# Altium schematic sheet CHARGING.SchDoc
size A; SheetNumber: 3; SheetTotal: 5
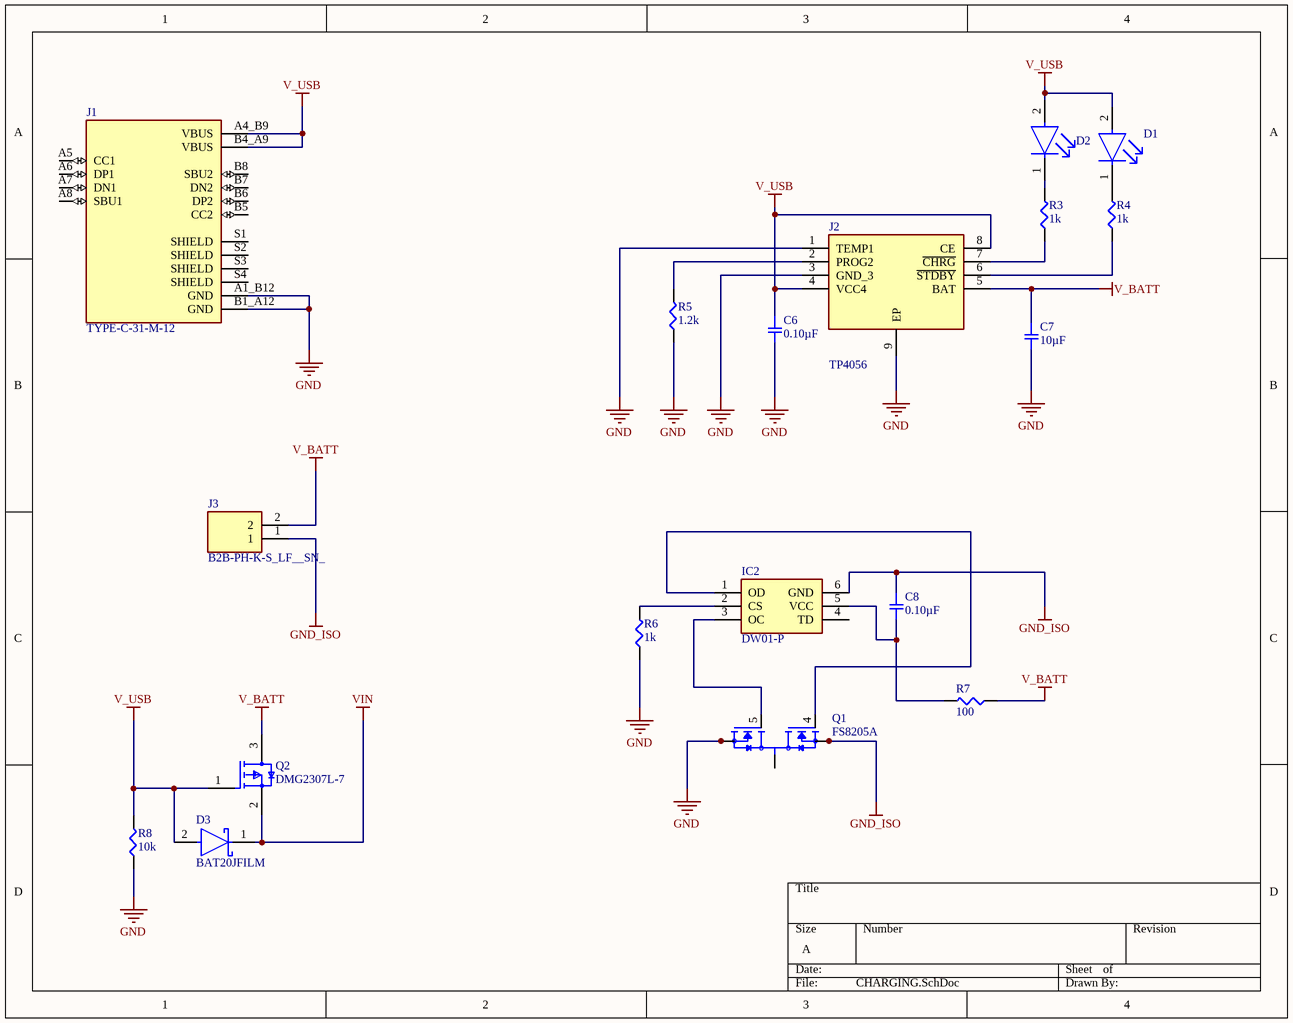
[diagram p0: CHARGING.SchDoc]

## Parts
C6  0.10µF  [SMD-0402C]
C7  10µF  [SMD-0402C]
C8  0.10µF  [SMD-0402C]
D1  SML-P12VTT86R  [FP-SML-P1-MFG]  (value not drawn)
D2  APHHS1005CGCK  [FP-APHHS1005CGCK-MFG]  (value not drawn)
D3  BAT20JFILM  [FP-BAT20JFILM-MFG]
IC2  DW01-P  [SOT95P280X135-6N]
J1  TYPE-C-31-M-12  [HRO_TYPE-C-31-M-12]
J2  TP4056  [SOIC127P600X175-9N]
J3  B2B-PH-K-S_LF__SN_  [SHDR2W50P0X200_1X2_590X450X600P]
Q1  FS8205A  [SOP65P640X120-8N]
Q2  DMG2307L-7  [FP-SOT23-MFG]
R3  1k  [SMD-0402-RES]
R4  1k  [SMD-0402-RES]
R5  1.2k  [SMD-0402-RES]
R6  1k  [SMD-0402-RES]
R7  100  [SMD-0402-RES]
R8  10k  [SMD-0402-RES]

## Nets
GND: C6.2 C7.2 J1.A1_B12(GND) J1.B1_A12(GND) J2.1(TEMP1) J2.3(GND_3) J2.9(EP) Q1.6(S2) Q1.7(S2) R5.1 R6.1 R8.1
GND_ISO: C8.1 IC2.6(GND) J3.1 Q1.2(S1) Q1.3(S1)
V_BATT: C7.1 J2.5(BAT) J3.2 Q2.3(D) R7.1
V_USB: C6.1 D1.2(A) D2.2(A) D3.2(A) J1.A4_B9(VBUS) J1.B4_A9(VBUS) J2.4(VCC4) J2.8(CE) Q2.1(G) R8.2
VIN: D3.1(K) Q2.2(S)
NetC8_2: C8.2 IC2.5(VCC) R7.2
NetD1_1: D1.1(C) R4.2
NetD2_1: D2.1(C) R3.2
NetIC2_1: IC2.1(OD) Q1.4(G1)
NetIC2_2: IC2.2(CS) R6.2
NetIC2_3: IC2.3(OC) Q1.5(G2)
NetJ2_2: J2.2(PROG2) R5.2
NetJ2_6: J2.6(~{STDBY}) R4.1
NetJ2_7: J2.7(~{CHRG}) R3.1
NetQ1_1: Q1.1(D12) Q1.8(D12)

Not connected (* = marked no-connect by the designer): IC2 4(TD); J1 A5(CC1) A6(DP1) A7(DN1) A8(SBU1) B5(CC2) B6(DP2) B7(DN2) B8(SBU2) S1(SHIELD) S2(SHIELD) S3(SHIELD) S4(SHIELD)

## Library data of the parts
C6 C8 = GCM155R71C104KA55D: CAP CER 0.1UF 16V X7R 0402; Manufacturer: Murata Electronics North America; Factory Stock: 0; Unit Price (USD): 0.1; Minimum Quantity: 1; Tolerance: ±10%; Datasheets: http://www.murata.com/~/media/webrenewal/support/library/catalog/products/capacitor/mlcc/c03e.ashx; Image: //media.digikey.com/Renders/Murata%20Renders/ZRB-SERIES-0402.jpg; Digi-Key Part Number: 490-4759-1-ND; Part Number: GCM155R71C104KA55D; Quantity Available: 734194; @ qty: 0; Packaging: Cut Tape (CT); Series: GCM; Part Status: Active; Value: 0.10µF; Voltage: 16V; Temperature Coefficient: X7R; Operating Temperature: -55°C ~ 125°C; Features: -; Ratings: AEC-Q200; Applications: Automotive; Mounting Type: Surface Mount, MLCC; Package / Case: 0402 (1005 Metric); Size / Dimension: 0.039" L x 0.020" W (1.00mm x 0.50mm); Height - Seated (Max): -; Thickness (Max): 0.022" (0.55mm); Lead Spacing: -; Lead Style: -
C7 = GRJ155R60J106ME11D: CAP CER 10UF 6.3V X5R 0402; Manufacturer: Murata Electronics North America; Factory Stock: 0; Unit Price (USD): 0.23; Minimum Quantity: 1; Tolerance: ±20%; Datasheets: http://psearch.en.murata.com/capacitor/product/GRJ155R60J106ME11%23.pdf; Image: //media.digikey.com/Renders/Murata%20Renders/ZRB-SERIES-0402.jpg; Digi-Key Part Number: 490-13211-1-ND; Part Number: GRJ155R60J106ME11D; Quantity Available: 64064; @ qty: 0; Packaging: Cut Tape (CT); Series: GRJ; Part Status: Active; Value: 10µF; Voltage: 6.3V; Temperature Coefficient: X5R; Operating Temperature: -55°C ~ 85°C; Features: Derating Recommended, Soft Termination; Ratings: -; Applications: Boardflex Sensitive; Mounting Type: Surface Mount, MLCC; Package / Case: 0402 (1005 Metric); Size / Dimension: 0.039" L x 0.020" W (1.00mm x 0.50mm); Height - Seated (Max): -; Thickness (Max): 0.028" (0.70mm); Lead Spacing: -; Lead Style: -
D1 = CMP-08952-000002-1: LED RED CLEAR 0402 SMD; Manufacturer: Rohm; Wavelength: 630nm; Luminous Intensity: 60mcd; Led Orientation: Top View; Forward Current: 20mA; Reverse Voltage: 5V; Power Dissipation: 50mW; Forward Voltage: 2V; Mouser Description: SML-P1 Series Red 0402 Clear 60 mcd 2V Surface Mount PICOLED? LED; Package: SML-P1; Colour: Red; Temperature Range Low: -40°C; Octopart: https://octopart.com/sml-p12vtt86r-rohm-34112315; Automotive: No; Temperature: -40°C to +85°C; Digikey Description: LED RED CLEAR 0402 SMD; ComponentLink2URL: https://www.rohm.com/datasheet/SML-P12VT(R)/sml-p1-e; Device Class L1: Optoelectronics; Device Class L3: unset; Category: Diode; Temperature Range High: +85°C; ComponentLink2Description: Datasheet; Lead Free: Yes; Manufacturer Part Number: SML-P12VTT86R; RoHS: TRUE; Device Class L2: LEDs; Height: 0.25mm
D2 = CMP-44529-000044-1: LED GREEN CLEAR CHIP SMD; Viewing Angle: 120°; Dominant Wavelength: 570nm; Test Current: 20mA; Luminous Intensity: 50mcd; Forward Voltage: 2.1V; Number of LEDs: 1; Lens Color: Clear; Packaging: Tape and Reel; Max Operating Temperature: 85°C; Illumination Color: Green; Length: 1mm; Mount: Surface Mount; Lens Style: Clear; Color: Green; Number of Pins: 2; Wavelength: 570nm; Case/Package: 0402; Width: 0.5mm; Package Quantity: 2000; Case Code (Metric): 1005; Height: 0.6mm; Lead Free: Lead Free; Case Code (Imperial): 0402; Forward Current: 20mA; Min Operating Temperature: -40°C
D3 = CMP-12187-000030-1: DIODE SCHOTTKY 23V 1A SOD323; Polarity: Standard; Element Configuration: Single; Capacitance: 30pF; Forward Voltage: 620mV; Max Surge Current: 5A; Peak Reverse Current: 12uA; Packaging: Tape and Reel; Weight: 0.01lb; Output Current: 1A; Lead Free: Lead Free; Forward Current: 1A; Mount: Surface Mount; Max Reverse Voltage (DC): 23V; Average Rectified Current: 1A; Max Operating Temperature: 150°C; Max Forward Surge Current (Ifsm): 5A; REACH SVHC: No SVHC; Current Rating: 1A; Length: 1.8mm; Radiation Hardening: No; Max Reverse Leakage Current: 12uA; Voltage Rating (DC): 23V; Height: 1.03mm; Peak Non-Repetitive Surge Current: 5A; Max Repetitive Reverse Voltage (Vrrm): 23V; Min Operating Temperature: -65°C; Number of Pins: 2; Width: 1.35mm; Package Quantity: 1
IC2 = DW01-P: Integrated Circuit; Manufacturer_Name: Fortune Semiconductor Corporation; Datasheet Link: https://cdn.sparkfun.com/assets/learn_tutorials/2/5/1/DW01-P_DataSheet_V10.pdf; Height: 1.35mm; Manufacturer_Part_Number: DW01-P
J1 = TYPE-C-31-M-12: USB Connectors 24 Receptacle 1 8.94*7.3mm RoHS; MF: HRO Electronics Co., Ltd.; Price: None; Value: *; SnapEDA_Link: https://www.snapeda.com/parts/TYPE-C-31-M-12/HRO+Electronics+Co.%252C+Ltd./view-part/?ref=snap; Package: Package; Availability: Not in stock; Check_prices: https://www.snapeda.com/parts/TYPE-C-31-M-12/HRO+Electronics+Co.%252C+Ltd./view-part/?ref=eda; MP: TYPE-C-31-M-12
J2 = TP4056: Connector; Manufacturer_Name: NanJing Top Power; Datasheet Link: https://dlnmh9ip6v2uc.cloudfront.net/datasheets/Prototyping/TP4056.pdf; Height: 1.75mm; Manufacturer_Part_Number: TP4056
J3 = B2B-PH-K-S_LF__SN_: Connector; Manufacturer_Name: JST (JAPAN SOLDERLESS TERMINALS); Manufacturer_Part_Number: B2B-PH-K-S(LF)(SN); Datasheet Link: https://datasheet.lcsc.com/szlcsc/JST-Sales-America-B2B-PH-K-S-LF-SN_C131337.pdf; Height: 6mm; Mouser Part Number: 306-B2BPHKSLFSNPP; Mouser Price/Stock: https://www.mouser.co.uk/ProductDetail/JST-Commercial/B2B-PH-K-SLFSN?qs=cdbOS8ANM9AlozzPlOt72g%3D%3D; Arrow Part Number: B2B-PH-K-S(LF)(SN); Arrow Price/Stock: https://www.arrow.com/en/products/b2b-ph-k-s-lf-sn/jst-manufacturing?utm_currency=USD&region=europe
Q1 = FS8205A: MF: Fortune Semiconductor; SnapEDA_Link: https://www.snapeda.com/parts/FS8205A/Fortune+Semiconductor/view-part/?ref=snap; Package: Package; Value: *; MP: FS8205A; Check_prices: https://www.snapeda.com/parts/FS8205A/Fortune+Semiconductor/view-part/?ref=eda
Q2 = CMP-12801-000080-1: MOSFET P-CH 30V 2.5A SOT-23; Gate to Source Voltage (Vgs): 20V; Rise Time: 7.3ns; Power Dissipation: 1.36W; Rds On Max: 90mR; Fall Time: 13.4ns; Number of Channels: 1; Turn-On Delay Time: 4.8ns; Element Configuration: Single; Turn-Off Delay Time: 22.4ns; Input Capacitance: 371.3pF; Continuous Drain Current (ID): 3.8A; Max Power Dissipation: 760mW; Min Operating Temperature: -55°C; Width: 1.4mm; Packaging: Tape and Reel; Max Operating Temperature: 150°C; Case/Package: SOT-23; Weight: 0.000282oz; Length: 3mm; Lead Free: Lead Free; Package Quantity: 3000; Radiation Hardening: No; Drain to Source Resistance: 90mR; Height: 1mm; REACH SVHC: No SVHC; Number of Pins: 3; Number of Elements: 1; Drain to Source Voltage (Vdss): 30V; Mount: Surface Mount
R3 R4 R6 = ERJ-2GEJ102X: RES SMD 1K OHM 5% 1/10W 0402; Manufacturer: Panasonic Electronic Components; Factory Stock: 0; Unit Price (USD): 0.00350; @ qty: 1500; Minimum Quantity: 1; Power (Watts): 0.1W, 1/10W; Temperature Coefficient: ±200ppm/°C; Part Number: ERJ-2GEJ102X; Datasheets: http://industrial.panasonic.com/www-cgi/jvcr13pz.cgi?E+PZ+3+AOA0001+ERJ2GEJ102X+7+WW; Image: //media.digikey.com/Photos/Panasonic%20Photos/ERJ-PA2-Series.jpg; Digi-Key Part Number: P1.0KJCT-ND; Quantity Available: 1939857; Packaging: Cut Tape (CT); Series: ERJ; Part Status: Active; Value: 1k; Tolerance: ±5%; Composition: Thick Film; Features: Automotive AEC-Q200; Operating Temperature: -55°C ~ 155°C; Package / Case: 0402 (1005 Metric); Supplier Device Package: 0402; Size / Dimension: 0.039" L x 0.020" W (1.00mm x 0.50mm); Height - Seated (Max): 0.016" (0.40mm); Number of Terminations: 2; Failure Rate: -
R5 = ERJ-2GEJ122X: RES SMD 1.2K OHM 5% 1/10W 0402; Manufacturer: Panasonic Electronic Components; Factory Stock: 0; Unit Price (USD): 0.00350; @ qty: 1500; Minimum Quantity: 1; Power (Watts): 0.1W, 1/10W; Temperature Coefficient: ±200ppm/°C; Part Number: ERJ-2GEJ122X; Datasheets: http://industrial.panasonic.com/www-cgi/jvcr13pz.cgi?E+PZ+3+AOA0001+ERJ2GEJ122X+7+WW; Image: //media.digikey.com/Photos/Panasonic%20Photos/ERJ-PA2-Series.jpg; Digi-Key Part Number: P1.2KJCT-ND; Quantity Available: 248948; Packaging: Cut Tape (CT); Series: ERJ; Part Status: Active; Value: 1.2k; Tolerance: ±5%; Composition: Thick Film; Features: Automotive AEC-Q200; Operating Temperature: -55°C ~ 155°C; Package / Case: 0402 (1005 Metric); Supplier Device Package: 0402; Size / Dimension: 0.039" L x 0.020" W (1.00mm x 0.50mm); Height - Seated (Max): 0.016" (0.40mm); Number of Terminations: 2; Failure Rate: -
R7 = ERJ-2RHD1000X: RES SMD 100 OHM 0.5% 1/16W 0402; Manufacturer: Panasonic Electronic Components; Factory Stock: 0; Unit Price (USD): 0.01767; @ qty: 1500; Minimum Quantity: 1; Power (Watts): 0.063W, 1/16W; Temperature Coefficient: ±50ppm/°C; Part Number: ERJ-2RHD1000X; Datasheets: http://industrial.panasonic.com/www-cgi/jvcr13pz.cgi?E+PZ+3+AOA0001+ERJ2RHD1000X+8+WW; Image: //media.digikey.com/Photos/Panasonic%20Photos/ERJ-PA2-Series.jpg; Digi-Key Part Number: P15983CT-ND; Quantity Available: 37495; Packaging: Cut Tape (CT); Series: ERJ; Part Status: Active; Value: 100; Tolerance: ±0.5%; Composition: Thick Film; Features: Automotive AEC-Q200; Operating Temperature: -55°C ~ 125°C; Package / Case: 0402 (1005 Metric); Supplier Device Package: 0402; Size / Dimension: 0.039" L x 0.020" W (1.00mm x 0.50mm); Height - Seated (Max): 0.016" (0.40mm); Number of Terminations: 2; Failure Rate: -
R8 = ERJ-2GEJ103X: RES SMD 10K OHM 5% 1/10W 0402; Manufacturer: Panasonic Electronic Components; Factory Stock: 0; Unit Price (USD): 0.00350; @ qty: 1500; Minimum Quantity: 1; Power (Watts): 0.1W, 1/10W; Temperature Coefficient: ±200ppm/°C; Part Number: ERJ-2GEJ103X; Datasheets: http://industrial.panasonic.com/www-cgi/jvcr13pz.cgi?E+PZ+3+AOA0001+ERJ2GEJ103X+7+WW; Image: //media.digikey.com/Photos/Panasonic%20Photos/ERJ-PA2-Series.jpg; Digi-Key Part Number: P10KJCT-ND; Quantity Available: 2560215; Packaging: Cut Tape (CT); Series: ERJ; Part Status: Active; Value: 10k; Tolerance: ±5%; Composition: Thick Film; Features: Automotive AEC-Q200; Operating Temperature: -55°C ~ 155°C; Package / Case: 0402 (1005 Metric); Supplier Device Package: 0402; Size / Dimension: 0.039" L x 0.020" W (1.00mm x 0.50mm); Height - Seated (Max): 0.016" (0.40mm); Number of Terminations: 2; Failure Rate: -